# Altium schematic sheet Encoders.SchDoc
size Letter
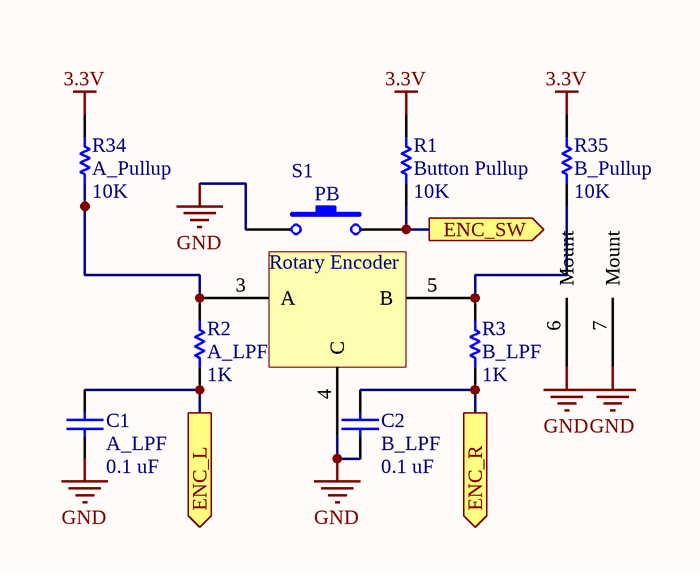
[diagram p0: Encoders.SchDoc]

## Parts
C1  A_LPF  value 0.1 uF  [C0805]
C2  B_LPF  value 0.1 uF  [C0805]
R1  Button Pullup  value 10K  [6-0805_N]
R2  A_LPF  value 1K  [6-0805_N]
R3  B_LPF  value 1K  [6-0805_N]
R34  A_Pullup  value 10K  [6-0805_N]
R35  B_Pullup  value 10K  [6-0805_N]
S1  Rotary Encoder  [Rotary Encoder SF]  (value not drawn)

## Ports
ENC_L (out), ENC_R (out), ENC_SW (out)

## Nets
3.3V: R1.1 R34.1 R35.1
GND: C1.1 C2.1 S1.1 S1.4(C) S1.6(Mount) S1.7(Mount)
ENC_L: C1.2 R2.2 ; port ENC_L
ENC_R: C2.2 R3.2 ; port ENC_R
ENC_SW: R1.2 S1.2 ; port ENC_SW
NetR2_1: R2.1 R34.2 S1.3(A)
NetR3_1: R3.1 R35.2 S1.5(B)

## Notes on the sheet
- (in symbol Rotary Encoder) PB

## Library data of the parts
C1 C2 = Cap: Capacitor; Published: 8-Jun-2000; LatestRevisionDate: 17-Jul-2002; LatestRevisionNote: Re-released for DXP Platform.; PackageReference: RAD-0.3; Publisher: Altium Limited; PackageDescription: Radial Cap, Thru-Hole; 2 Leads; 0.3 in Pin Spacing
R1-R3 R34 R35 = Res1: Resistor; Published: 8-Jun-2000; LatestRevisionDate: 17-Jul-2002; LatestRevisionNote: Re-released for DXP Platform.; PackageReference: AXIAL-0.3; Publisher: Altium Limited; PackageDescription: Axial Device, Thru-Hole; 2 Leads; 0.3 in Pin Spacing